# EAGLE design v1_arduino (EAGLE 7.2.0)
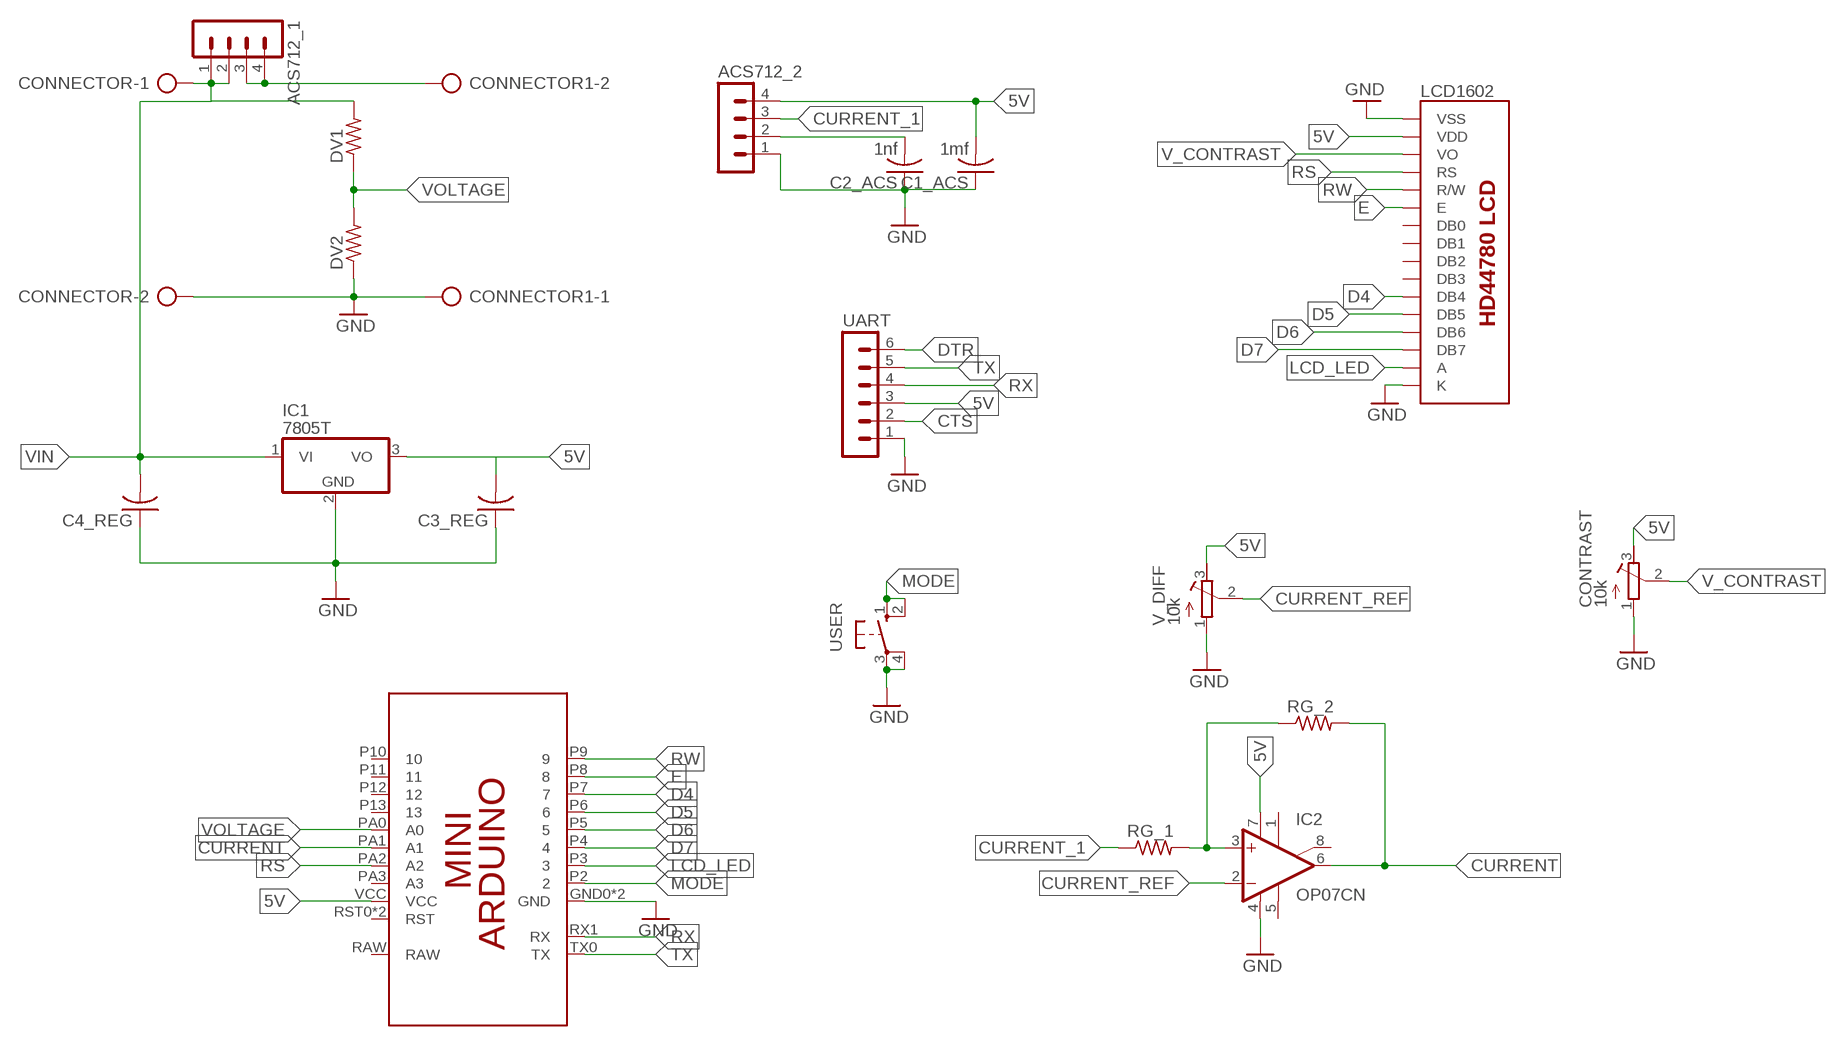
[diagram p0: schematic, sheet 1]

## Parts
ACS712_1  MA04-1  [MA04-1]
ACS712_2  MA04-1  [MA04-1]
C1_ACS  1mf  C-USC0805K  [C0805K]
C2_ACS  1nf  C-USC0805K  [C0805K]
C3_REG  C-USC0805K  [C0805K]
C4_REG  C-USC0805K  [C0805K]
CONNECTOR  AK500/2-H  [AK500/2-H]
CONNECTOR1  AK500/2-H  [AK500/2-H]
CONTRAST  10k  R-TRIMM3296W  [RTRIM3296W]
DV1  R-US_M0805  [M0805]
DV2  R-US_M0805  [M0805]
IC1  7805T  [TO220H]
IC2  OP07CN  [DIL08]
LCD1602  LCD-HD447803-HOLES16X2-3-HOLES  [LCD-16X2-3HOLES]
RG_1  R-US_M0805  [M0805]
RG_2  R-US_M0805  [M0805]
U$1  ARDUINO_PRO_MINI  [ARDUINO_PRO_MINI]
UART  MA06-1  [MA06-1]
USER  40-XX  [B3F-40XX]
V_DIFF  10k  R-TRIMM3296W  [RTRIM3296W]

## Nets
5V: ACS712_2.4 C1_ACS.2 C3_REG.2 CONTRAST.3(A) IC1.3(VO) IC2.7(V+) LCD1602.2(VDD) U$1.VCC UART.3 V_DIFF.3(A)
CTS: UART.2
CURRENT: IC2.6(OUT) RG_2.2 U$1.PA1(A1)
CURRENT_1: ACS712_2.3 RG_1.1
CURRENT_REF: IC2.2(-IN) V_DIFF.2(S)
D4: LCD1602.11(DB4) U$1.P7
D5: LCD1602.12(DB5) U$1.P6
D6: LCD1602.13(DB6) U$1.P5
D7: LCD1602.14(DB7) U$1.P4
DTR: UART.6
E: LCD1602.6(E) U$1.P8
GND: ACS712_2.1 C1_ACS.1 C2_ACS.1 C3_REG.1 C4_REG.1 CONNECTOR1.1 CONNECTOR.2 CONTRAST.1(E) DV2.1 IC1.2(GND) IC2.4(V-) LCD1602.1(VSS) LCD1602.16(K) U$1.GND0(GND) U$1.GND1(GND) UART.1 USER.3(P) USER.4(P1) V_DIFF.1(E)
LCD_LED: LCD1602.15(A) U$1.P3
MODE: U$1.P2 USER.1(S) USER.2(S1)
N$2: ACS712_1.3 ACS712_1.4 CONNECTOR1.2
N$3: IC2.3(+IN) RG_1.2 RG_2.1
N$9: ACS712_2.2 C2_ACS.2
RS: LCD1602.4(RS) U$1.PA2(A2)
RW: LCD1602.5(R/W) U$1.P9
RX: U$1.RX1(RX) UART.4
TX: U$1.TX0(TX) UART.5
V_CONTRAST: CONTRAST.2(S) LCD1602.3(VO)
VIN: ACS712_1.1 ACS712_1.2 C4_REG.2 CONNECTOR.1 DV1.2 IC1.1(VI)
VOLTAGE: DV1.1 DV2.2 U$1.PA0(A0)
Unconnected: IC2.1(ON1) IC2.5(OPT) IC2.8(ON2) LCD1602.7(DB0) LCD1602.8(DB1) LCD1602.9(DB2) LCD1602.10(DB3) U$1.P10 U$1.P11 U$1.P12 U$1.P13 U$1.PA3(A3) U$1.RAW U$1.RST0(RST) U$1.RST1(RST)

## Library data of the parts
ACS712_1 ACS712_2 = con-lstb:MA04-1: PIN HEADER; OC_FARNELL: unknown; OC_NEWARK: unknown
C1_ACS C2_ACS C3_REG C4_REG = resistor:C-US: CAPACITOR, American symbol
CONNECTOR CONNECTOR1 = con-ptr500:AK500/2-H: CONNECTOR Aug. 2004 / PTR Meßtechnik: Die Bezeichnung der Serie AK505 wurde geändert. Es handelt sich hierbei um AK500 in horizontaler Ausführung.; OC_FARNELL: unknown; OC_NEWARK: unknown
CONTRAST V_DIFF = resistor:R-TRIMM: Trimm resistor
DV1 DV2 RG_1 RG_2 = resistor:R-US_: RESISTOR, American symbol
IC1 = linear:78*: Positive VOLTAGE REGULATOR Source: http://cache.national.com/ds/LM/LM78L05.pdf http://www.fairchildsemi.com/ds/LM/LM7805.pdf
IC2 = linear:OP07*: OP AMP
LCD1602 = HD44780LCD:LCD-HD44780
U$1 = E14_Arduino:ARDUINO_PRO_MINI
UART = con-lstb:MA06-1: PIN HEADER; OC_FARNELL: unknown; OC_NEWARK: unknown
USER = switch-omron:40-XX: OMRON SWITCH; MF: OMRON COMPONENTS USA; MPN: B3F-4000; OC_FARNELL: 176434; OC_NEWARK: 36K3105

## Board
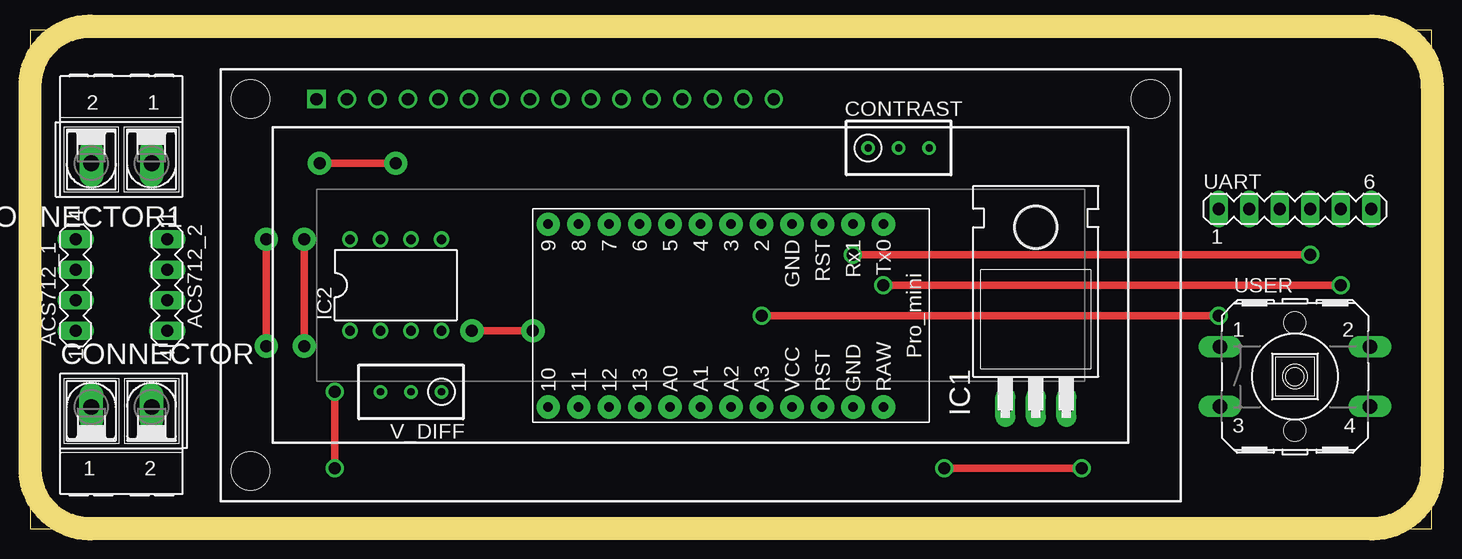
[diagram p1: board, top side]
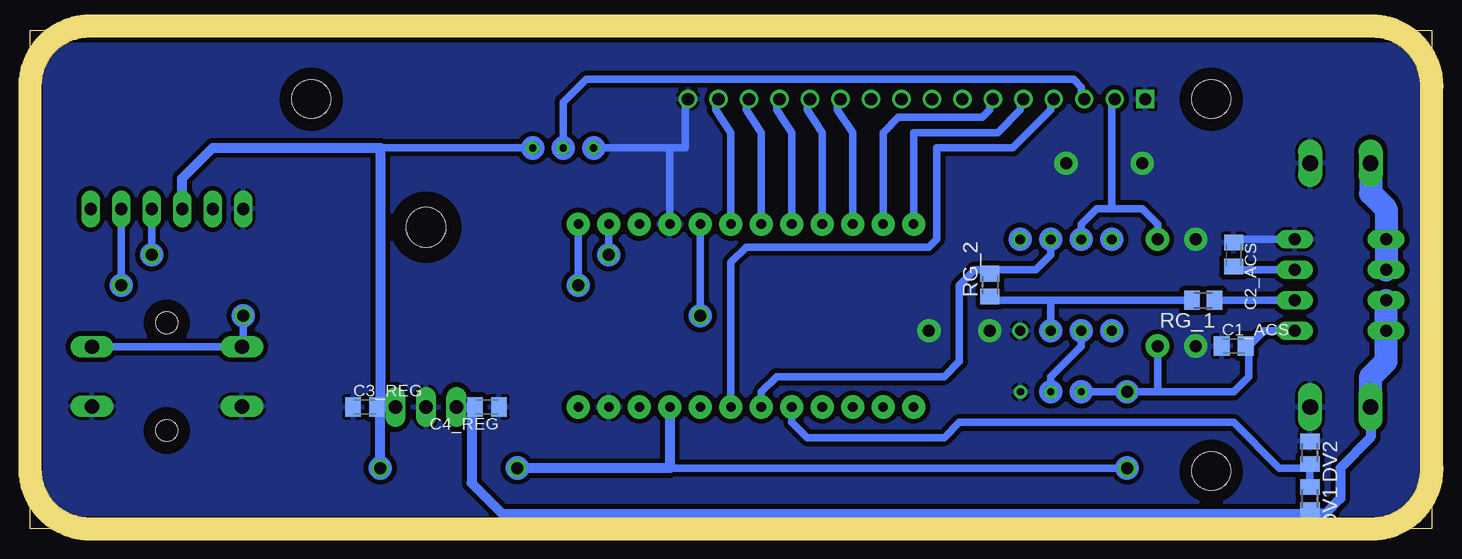
[diagram p2: board, bottom side, seen from below]

Size 116.82 x 41.58 mm. Coordinates in mm from the lower left corner, seen from the top.
Outline: 0,0 116.82,0 116.82,41.58 0,41.58 0,0
Copper layers (1*16): Top 0.035mm / dielectric 1.5mm / Bottom 0.035mm
Design rules "default": minimum track width 10mil, minimum drill 24mil, track to track 8mil, track to pad 8mil, pad to pad 8mil, via to via 8mil, smd to smd 8mil, copper to edge 40mil, drill to drill 8mil, minimum pad ring 10mil, minimum via ring 8mil, stop-mask expansion 4mil, vias tented up to drill 0mil, thermal gap 10mil
Milling: 8 lines

### Footprints (pad centres in the part's own frame; a part is rotated, then mirrored left to right if it is on the bottom)
MA04-1 = drill 1.016 long: 1 -3.81,0; 2 -1.27,0; 3 1.27,0; 4 3.81,0
C0805K = smd 1.3 x 1.6: 1 -1,0; 2 1,0
AK500/2-H = drill 1.321 long: 1 -2.515,0; 2 2.515,0
RTRIM3296W = drill 0.61: 1 0,-2.54; 2 0,0; 3 0,2.54
M0805 = smd 1.3 x 1.6: 1 -0.95,0; 2 0.95,0
TO220H = drill 1.118 long: 1 -2.54,-10.16; 2 0,-10.16; 3 2.54,-10.16 | hole 3.302: 0,4.826
DIL08 = drill 0.813 pad 1.27: 1 -3.81,-3.81; 2 -1.27,-3.81; 3 1.27,-3.81; 4 3.81,-3.81; 5 3.81,3.81; 6 1.27,3.81; 7 -1.27,3.81; 8 -3.81,3.81
LCD-16X2-3HOLES = drill 1.016 square: 1 -32,15.5 | drill 1.016: 2 -29.46,15.5; 3 -26.92,15.5; 4 -24.38,15.5; 5 -21.84,15.5; 6 -19.3,15.5; 7 -16.76,15.5; 8 -14.22,15.5; 9 -11.68,15.5; 10 -9.14,15.5; 11 -6.6,15.5; 12 -4.06,15.5; 13 -1.52,15.5; 14 1.02,15.5; 15 3.56,15.5; 16 6.1,15.5 | hole 3.2: -37.5,15.5; -37.5,-15.5; 37.5,15.5
ARDUINO_PRO_MINI = drill 0.8 pad 1.93: GND0 0,20.32; GND1 15.24,25.4; P2 0,17.78; P3 0,15.24; P4 0,12.7; P5 0,10.16; P6 0,7.62; P7 0,5.08; P8 0,2.54; P9 0,0; P10 15.24,0; P11 15.24,2.54; P12 15.24,5.08; P13 15.24,7.62; PA0 15.24,10.16; PA1 15.24,12.7; PA2 15.24,15.24; PA3 15.24,17.78; RAW 15.24,27.94; RST0 0,22.86; RST1 15.24,22.86; RX1 0,25.4; TX0 0,27.94; VCC 15.24,20.32
MA06-1 = drill 1.016 long: 1 -6.35,0; 2 -3.81,0; 3 -1.27,0; 4 1.27,0; 5 3.81,0; 6 6.35,0
B3F-40XX = drill 1.194 long: 1 -6.248,2.489; 2 6.248,2.489; 3 -6.248,-2.489; 4 6.248,-2.489 | hole 1.803: 0,-4.496; 0,4.496

### Placement (x,y rotation side)
ACS712_1  3.81,20.32 90 top
ACS712_2  11.43,20.32 270 top
C1_ACS  16.51,15.24 0 bottom
C2_ACS  16.51,22.86 270 bottom
C3_REG  88.9,10.16 0 bottom
C4_REG  78.74,10.16 180 bottom
CONNECTOR  7.62,10.16 0 top
CONNECTOR1  7.62,30.48 180 top
CONTRAST  72.39,31.75 270 top
DV1  10.16,2.54 270 bottom
DV2  10.16,6.35 270 bottom
IC1  83.82,20.32 0 top
IC2  30.48,20.32 0 top
LCD1602  55.88,20.32 0 top
RG_1  19.05,19.05 180 bottom
RG_2  36.83,20.32 90 bottom
U$1  43.18,25.4 270 top
UART  105.41,26.67 0 top
USER  105.41,12.7 0 top
V_DIFF  31.75,11.43 90 top

### Tracks (layer width: path | path; a pad name or v marks a point on that pad's centre or on a via)
5V  (via drill 1, 1 pad 1.93)
  Top 0.61: v22.86,15.24 v22.86,24.13 | v25.4,11.43 v25.4,5.08 | v76.2,5.08 v87.63,5.08
  Bottom 0.61: ACS712_2.4 13.97,16.51 15.24,15.24 | IC1.3 C3_REG.2 87.63,9.89 | 22.86,11.43 v25.4,11.43 V_DIFF.3 | 22.86,11.43 16.51,11.43 15.24,12.7 15.24,15.24 | 15.24,15.24 C1_ACS.2 | v22.86,24.13 22.86,25.4 24.13,26.67 26.67,26.67 | 26.67,26.67 27.94,26.67 29.21,25.4 IC2.7 | LCD1602.2 26.67,35.56 26.67,26.67 | CONTRAST.3 87.63,31.75 | v25.4,5.08 63.5,5.08 | v22.86,15.24 22.86,11.43
  Bottom 0.813: UART.3 104.14,29.21 101.6,31.75 87.63,31.75 87.63,9.89 v87.63,5.08 | U$1.VCC 63.5,5.08 v76.2,5.08
CURRENT
  Bottom 0.61: IC2.6 31.75,22.86 33.02,21.59 36.83,21.59 | U$1.PA1 55.88,11.43 54.61,12.7 40.64,12.7 39.37,13.97 39.37,20.32 38.1,21.59 36.83,21.59 | 36.83,21.59 RG_2.2
CURRENT_1
  Bottom 0.61: ACS712_2.3 RG_1.1
CURRENT_REF
  Bottom 0.61: IC2.2 29.21,15.24 31.75,12.7 V_DIFF.2
D4
  Bottom 0.61: LCD1602.11 49.53,35.56 49.53,34.92 48.26,33.02 U$1.P7
D5
  Bottom 0.61: LCD1602.12 52.07,35.56 52.07,34.92 50.8,33.02 U$1.P6
D6
  Bottom 0.61: LCD1602.13 54.61,35.56 54.61,34.92 53.34,33.02 U$1.P5
D7
  Bottom 0.61: LCD1602.14 57.15,35.56 57.15,34.92 55.88,33.02 U$1.P4
E
  Bottom 0.61: LCD1602.6 36.83,35.56 36.83,34.92 37.47,34.29 44.45,34.29 45.72,33.02 U$1.P8
GND  (via drill 1 pad 1.93)
  Top 0.61: v24.13,30.48 v30.48,30.48 | v19.68,24.13 v19.68,15.24 | v36.83,16.51 v41.91,16.51
  Bottom 0.61: ACS712_2.1 16.51,24.13 C2_ACS.1 | LCD1602.16 62.23,35.56 62.23,31.75 63.5,31.75 | 63.5,31.75 CONTRAST.1 | U$1.GND0 63.5,31.75
  pour Bottom (isolate 0.406): 0,41.91 116.84,41.91 116.84,0 0,0
LCD_LED
  Bottom 0.61: LCD1602.15 59.69,35.56 59.69,34.92 58.42,33.02 U$1.P3
MODE  (via drill 1)
  Top 0.61: v60.96,17.78 v99.06,17.78
  Bottom 0.61: USER.2 USER.1 99.06,15.24 v99.06,17.78 | U$1.P2 v60.96,17.78
N$1  (via drill 1 pad 1.93)
  other vias: 18.38,4.78
N$2
  Bottom 1.93: CONNECTOR1.2 5.11,27.96 3.81,26.67 ACS712_1.4 ACS712_1.3
N$3
  Bottom 0.61: RG_1.2 31.75,19.05 | IC2.3 31.75,19.05 | 31.75,19.05 36.83,19.05 RG_2.1
N$4  (via drill 1 pad 1.93)
  other vias: 18.4,35.83
N$5  (via drill 1 pad 1.93)
  other vias: 93.38,35.81
N$9
  Bottom 0.61: ACS712_2.2 16.51,21.59 C2_ACS.2
RS
  Bottom 0.61: LCD1602.4 31.75,35.56 31.75,34.92 34.92,31.75 41.27,31.75 41.27,24.13 41.91,23.5 57.15,23.5 58.42,22.23 U$1.PA2
RW
  Bottom 0.61: LCD1602.5 34.29,35.56 34.29,34.92 36.2,33.02 43.18,33.02 U$1.P9
RX  (via drill 1)
  Top 0.61: v68.58,22.86 v106.68,22.86
  Bottom 0.61: U$1.RX1 v68.58,22.86 | v106.68,22.86 UART.4
TX  (via drill 1)
  Top 0.61: v71.12,20.32 v109.22,20.32
  Bottom 0.61: U$1.TX0 v71.12,20.32 | v109.22,20.32 UART.5
V_CONTRAST
  Bottom 0.61: LCD1602.3 29.21,35.56 29.21,36.83 29.84,37.47 70.48,37.47 72.39,35.56 CONTRAST.2
VIN
  Bottom 0.61: C4_REG.2 80.01,9.89 80.01,10.16
  Bottom 0.813: CONNECTOR.1 5.11,7.64 7.62,5.08 7.62,2.54 8.89,1.27 10.47,1.27 DV1.2 10.48,1.27 77.47,1.27 80.01,3.81 80.01,9.89 | IC1.1 80.01,10.16
  Bottom 1.93: CONNECTOR.1 5.11,12.68 3.81,13.97 ACS712_1.1 ACS712_1.2
VOLTAGE
  Bottom 0.61: DV1.1 10.16,5.08 | U$1.PA0 53.34,8.89 52.07,7.62 40.64,7.62 39.37,8.89 16.51,8.89 12.7,5.08 10.16,5.08 | 10.16,5.08 DV2.2
(copper drawn outside any net)
  shapes: Bottom circle x22